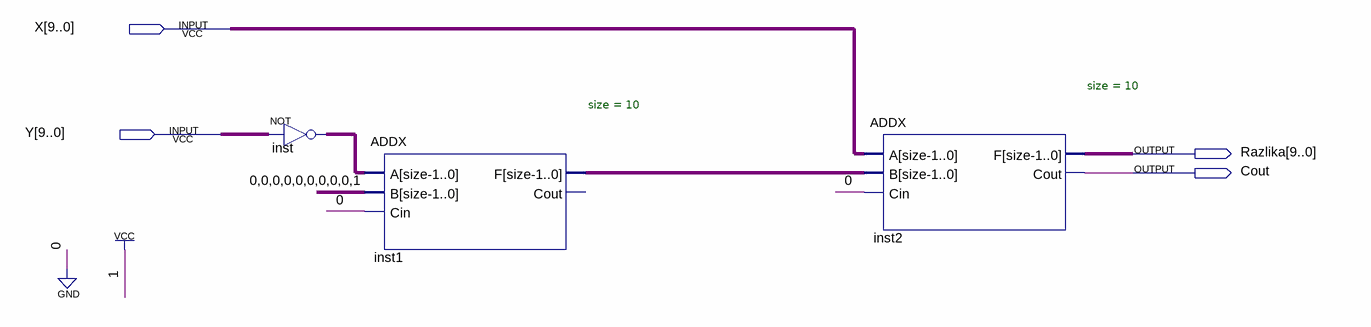
[diagram p0: schematic sheet]
// Quartus schematic SUB10.bdf as structural Verilog: 3 symbols, 4 pins
module SUB10 (
  input  [9:0] X,
  input  [9:0] Y,
  output [9:0] Razlika,
  output Cout
);

  wire [9:0] inst1_f, inst_out;

  assign inst_out = ~Y;  // NOT inst, 10 bits wide
  ADDX #(.size(10)) inst1 (.A(inst_out), .B(10'b0000000001), .Cin(1'b0), .F(inst1_f));  // open: Cout
  ADDX #(.size(10)) inst2 (.A(X), .B(inst1_f), .Cin(1'b0), .F(Razlika), .Cout(Cout));
endmodule
